# EAGLE design untitled (EAGLE 5.11)
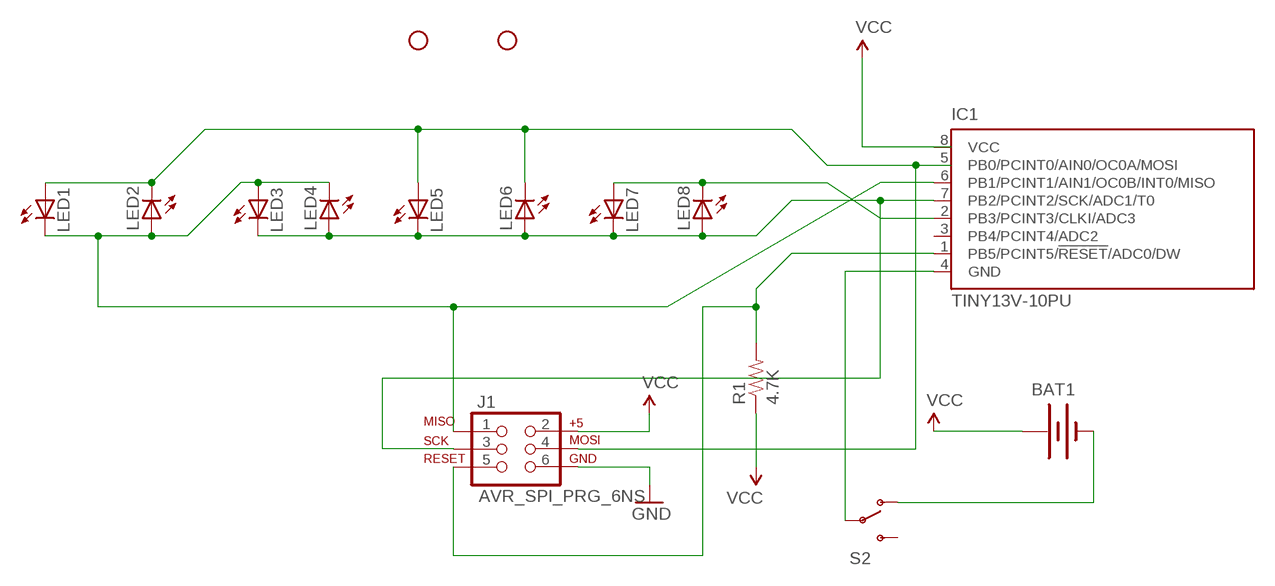
[diagram p0: schematic, sheet 1]

## Parts
BAT1  BATTERY20PTH  [BATTCOM_20MM_PTH]
IC1  TINY13V-10PU  [DIL08]
J1  AVR_SPI_PRG_6NS  [2X3-NS]
JP1  STAND-OFF  [STAND-OFF]
JP2  STAND-OFF  [STAND-OFF]
LED1  LED5MM  [LED5MM]
LED2  LED5MM  [LED5MM]
LED3  LED5MM  [LED5MM]
LED4  LED5MM  [LED5MM]
LED5  LED5MM  [LED5MM]
LED6  LED5MM  [LED5MM]
LED7  LED5MM  [LED5MM]
LED8  LED5MM  [LED5MM]
R1  4.7K  RESISTORPTH1  [AXIAL-0.3]
S2  SWITCH-SPSTPTH  [SWITCH-SPDT]

## Nets
GND: J1.6
N$1: IC1.1(PB5/PCINT5/!RESET!/ADC0/DW) J1.5 R1.P$2
N$2: IC1.7(PB2/PCINT2/SCK/ADC1/T0) J1.3 LED3.K(C) LED4.A LED5.K(C) LED6.A LED7.K(C) LED8.A
N$3: IC1.2(PB3/PCINT3/CLKI/ADC3) LED7.A LED8.K(C)
N$4: IC1.4(GND) S2.2(P)
N$5: J1.4 LED1.A LED2.K(C) LED5.A LED6.K(C)
N$6: BAT1.2(-) S2.1(O)
N$7: IC1.6(PB1/PCINT1/AIN1/OC0B/INT0/MISO) J1.1 LED1.K(C) LED2.A LED3.A LED4.K(C)
VCC: BAT1.1(+) J1.2 R1.P$1
Unconnected: IC1.3(PB4/PCINT4/ADC2) IC1.5(PB0/PCINT0/AIN0/OC0A/MOSI) S2.3(S)

## Power pins joined to a net without a drawn wire
VCC: IC1.8(VCC)

## Library data of the parts
BAT1 = SparkFun:BATTERY: Battery Holders Various common sizes : AA, AAA, 20mm coin cell and 12mm coin cell.
IC1 = atmel:TINY13: 8-bit AVR Microcontroller with 1K Bytes In-System Programmable Flash Source: http://www.atmel.com/dyn/resources/prod_documents/2535S.pdf; MPN: ATTINY13V-10PU; OC_FARNELL: 9171576; OC_NEWARK: 96K6523
J1 = SparkFun:AVR_SPI_PRG_6: AVR ISP 6 Pin This is the reduced ISP connector for AVR programming. Common on Arduino. This footprint will take up less PCB space and can be used with a 10-pin to 6-pin adapter such as SKU: BOB-08508
JP1 JP2 = SparkFun:STAND-OFF: Stand Off This is the mechanical footprint for a #4 phillips button head screw. Use the keepout ring to avoid running the screw head into surrounding components. SKU : PRT-00447
LED1-LED8 = led:LED: LED OSRAM: - CHIPLED LG R971, LG N971, LY N971, LG Q971, LY Q971, LO R971, LY R971 LH N974, LH R974 LS Q976, LO Q976, LY Q976 LO Q996 - Hyper CHIPLED LW Q18S LB Q993, LB Q99A, LB R99A - SideLED LS A670, LO A670, LY A670, LG A670, LP A670 LB A673, LV A673, LT A673, LW A673 LH A674 LY A675 LS A676, LA A676, LO A676, LY A676, LW A676 LS A679, LY A679, LG A679 - Hyper Micro SIDELED® LS Y876, LA Y876, LO Y876, LY Y876 LT Y87S - SmartLED LW L88C, LW L88S LB L89C, LB L89S, LG L890 LS L89K, LO L89K, LY L89K LS L896, LA L896, LO L896, LY L896 - TOPLED LS T670, LO T670, LY T670, LG T670, LP T670 LSG T670, LSP T670, LSY T670, LOP T670, LYG T670 LG T671, LOG T671, LSG T671 LB T673, LV T673, LT T673, LW T673 LH T674 LS T676, LA T676, LO T676, LY T676, LB T676, LH T676, LSB T676, LW T676 LB T67C, LV T67C, LT T67C, LS T67K, LO T67K, LY T67K, LW E67C LS E67B, LA E67B, LO E67B, LY E67B, LB E67C, LV E67C, LT E67C LW T67C LS T679, LY T679, LG T679 LS T770, LO T770, LY T770, LG T770, LP T770 LB T773, LV T773, LT T773, LW T773 LH T774 LS E675, LA E675, LY E675, LS T675 LS T776, LA T776, LO T776, LY T776, LB T776 LHGB T686 LT T68C, LB T68C - Hyper Mini TOPLED® LB M676 - Mini TOPLED Santana® LG M470 LS M47K, LO M47K, LY M47K Source: http://www.osram.convergy.de LUXEON: - LUMILED® LXK2-PW12-R00, LXK2-PW12-S00, LXK2-PW14-U00, LXK2-PW14-V00 LXK2-PM12-R00, LXK2-PM12-S00, LXK2-PM14-U00 LXK2-PE12-Q00, LXK2-PE12-R00, LXK2-PE12-S00, LXK2-PE14-T00, LXK2-PE14-U00 LXK2-PB12-K00, LXK2-PB12-L00, LXK2-PB12-M00, LXK2-PB14-N00, LXK2-PB14-P00, LXK2-PB14-Q00 LXK2-PR12-L00, LXK2-PR12-M00, LXK2-PR14-Q00, LXK2-PR14-R00 LXK2-PD12-Q00, LXK2-PD12-R00, LXK2-PD12-S00 LXK2-PH12-R00, LXK2-PH12-S00 LXK2-PL12-P00, LXK2-PL12-Q00, LXK2-PL12-R00 Source: www.luxeon.com KINGBRIGHT: KA-3528ASYC Source: www.kingbright.com
R1 = SparkFun:RESISTOR: Resistor Basic schematic elements and footprints for 0603, 1206, and PTH 1/10th watt (small) resistors.
S2 = SparkFun:SWITCH-SPST: SPST Switch Simple slide switch. Spark Fun Electronics SKU : COM-00102

## Net classes
0 default: width 0.305 mm, clearance 0.203 mm

## Board
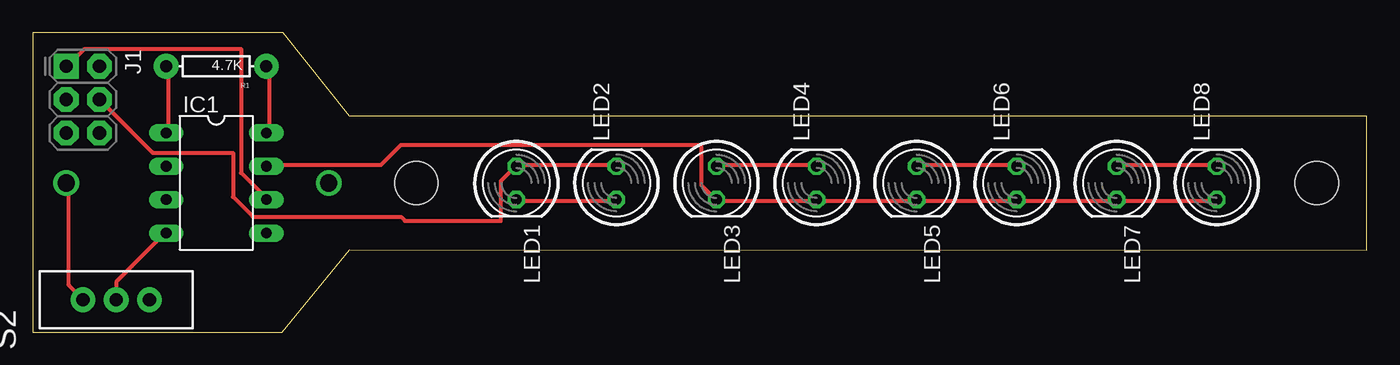
[diagram p1: board, top side]
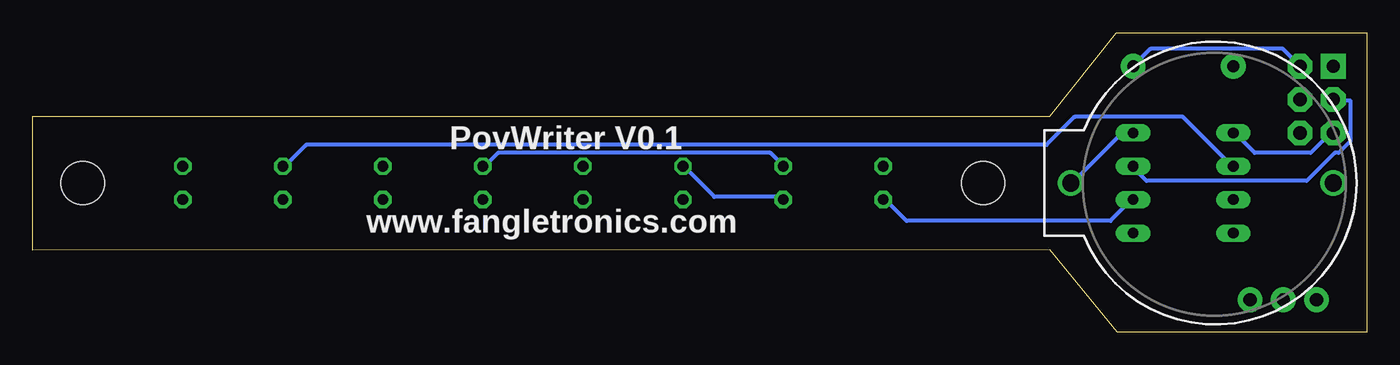
[diagram p2: board, bottom side, seen from below]

Size 101.59 x 22.78 mm. Coordinates in mm from the lower left corner, seen from the top.
Outline: 0,22.78 0,0 19,0 24.13,6.27 101.59,6.22 101.59,16.43 24.13,16.43 19.05,22.78 0,22.78
Copper layers (1*16): Top 0.035mm / dielectric 1.5mm / Bottom 0.035mm
Design rules "default": minimum track width 10mil, minimum drill 24mil, track to track 8mil, track to pad 8mil, pad to pad 8mil, via to via 8mil, smd to smd 8mil, copper to edge 40mil, drill to drill 8mil, minimum pad ring 10mil, minimum via ring 8mil, stop-mask expansion 4mil, vias tented up to drill 0mil, thermal gap 10mil

### Footprints (pad centres in the part's own frame; a part is rotated, then mirrored left to right if it is on the bottom)
BATTCOM_20MM_PTH = drill 1.3 round: 1 20,0; 2 0,0
DIL08 = drill 0.813 long: 1 -3.81,-3.81; 2 -1.27,-3.81; 3 1.27,-3.81; 4 3.81,-3.81; 5 3.81,3.81; 6 1.27,3.81; 7 -1.27,3.81; 8 -3.81,3.81
2X3-NS = drill 1.016 pad 1.88 square: 1 -2.54,-1.27 | drill 1.016 pad 1.88 octagon: 2 -2.54,1.27; 3 0,-1.27; 4 0,1.27; 5 2.54,-1.27; 6 2.54,1.27
STAND-OFF = hole 3.302: 0,0
LED5MM = drill 0.813 octagon: A -1.27,0; K 1.27,0
AXIAL-0.3 = drill 0.9 pad 1.88 round: P$1 -3.81,0; P$2 3.81,0
SWITCH-SPDT = drill 1.016 pad 1.88 round: 1 0,2.54; 2 0,0; 3 0,-2.54

### Placement (x,y rotation side)
BAT1  2.54,11.35 180 bottom
IC1  13.97,11.35 270 top
J1  3.81,17.7 270 top
JP1  97.79,11.35 0 top
JP2  29.21,11.35 0 top
LED1  36.83,11.35 270 top
LED2  44.45,11.35 90 top
LED3  52.07,11.35 270 top
LED4  59.69,11.35 90 top
LED5  67.31,11.35 270 top
LED6  74.93,11.35 90 top
LED7  82.55,11.35 270 top
LED8  90.17,11.35 90 top
R1  13.97,20.24 180 top
S2  6.35,2.46 90 top

### Tracks (layer width: path | path; a pad name or v marks a point on that pad's centre or on a via)
N$1
  Top 0.305: IC1.1 10.36,15.16 10.36,20.04 R1.P$2
  Bottom 0.305: J1.5 2.74,15.16 4.27,13.64 8.53,13.64 10.06,15.16 IC1.1
N$2
  Top 0.305: LED8.A 89.92,9.98 82.6,9.98 LED7.K 82.3,9.98 74.98,9.98 LED6.A 74.68,9.98 67.36,9.98 LED5.K 67.06,9.98 59.74,9.98 LED4.A 59.44,9.98 52.12,9.98 LED3.K 51.82,10.29 50.9,11.2 50.9,14.25 28.04,14.25 26.52,12.73 17.98,12.73 IC1.7
  Bottom 0.305: IC1.7 17.68,12.42 16.76,11.51 4.57,11.51 2.44,13.64 2.13,13.64 1.22,14.55 1.22,17.6 2.44,17.6 J1.3
N$3
  Top 0.305: LED8.K 89.92,12.73 82.6,12.73 LED7.A
  Bottom 0.305: IC1.2 10.36,12.73 14.02,16.38 22.25,16.38 24.38,14.25 80.77,14.25 82.3,12.73 LED7.A
N$4
  Top 0.305: IC1.4 10.06,7.54 6.4,3.89 6.4,2.67 S2.2
N$5
  Top 0.305: LED5.A 67.36,12.73 74.68,12.73 LED6.K | LED2.K 44.2,12.73 36.88,12.73 LED1.A 36.58,12.42 35.66,11.51 35.66,8.46 28.35,8.46 28.04,8.76 16.76,8.76 15.24,10.29 15.24,13.64 9.14,13.64 J1.4
  Bottom 0.305: LED5.A 67.06,12.73 66.14,13.64 45.41,13.64 44.5,12.73 LED2.K
N$6
  Top 0.305: S2.1 3.66,2.67 2.74,3.58 2.74,11.2 BAT1.2
N$7
  Top 0.305: LED3.A 52.12,12.73 59.44,12.73 LED4.K | LED2.A 44.2,9.98 36.88,9.98 LED1.K | J1.1 2.74,20.35 3.96,21.56 15.85,21.56 15.85,12.12 17.68,10.29 IC1.6
  Bottom 0.305: IC1.6 17.98,9.98 19.51,8.46 35.05,8.46 36.58,9.98 LED1.K | LED3.A 51.82,12.42 49.68,10.29 44.5,10.29 LED2.A
VCC
  Top 0.305: IC1.8 17.98,15.16 17.98,20.04 R1.P$1
  Bottom 0.305: J1.2 6.4,21.56 16.46,21.56 R1.P$1 | BAT1.1 22.25,11.51 18.59,15.16 IC1.8

### Text on the board
bPlace: PovWriter V0.1 | www.fangletronics.com